# EAGLE design SOIC20-TSSOP20 v1.0 (EAGLE 7.2.0)
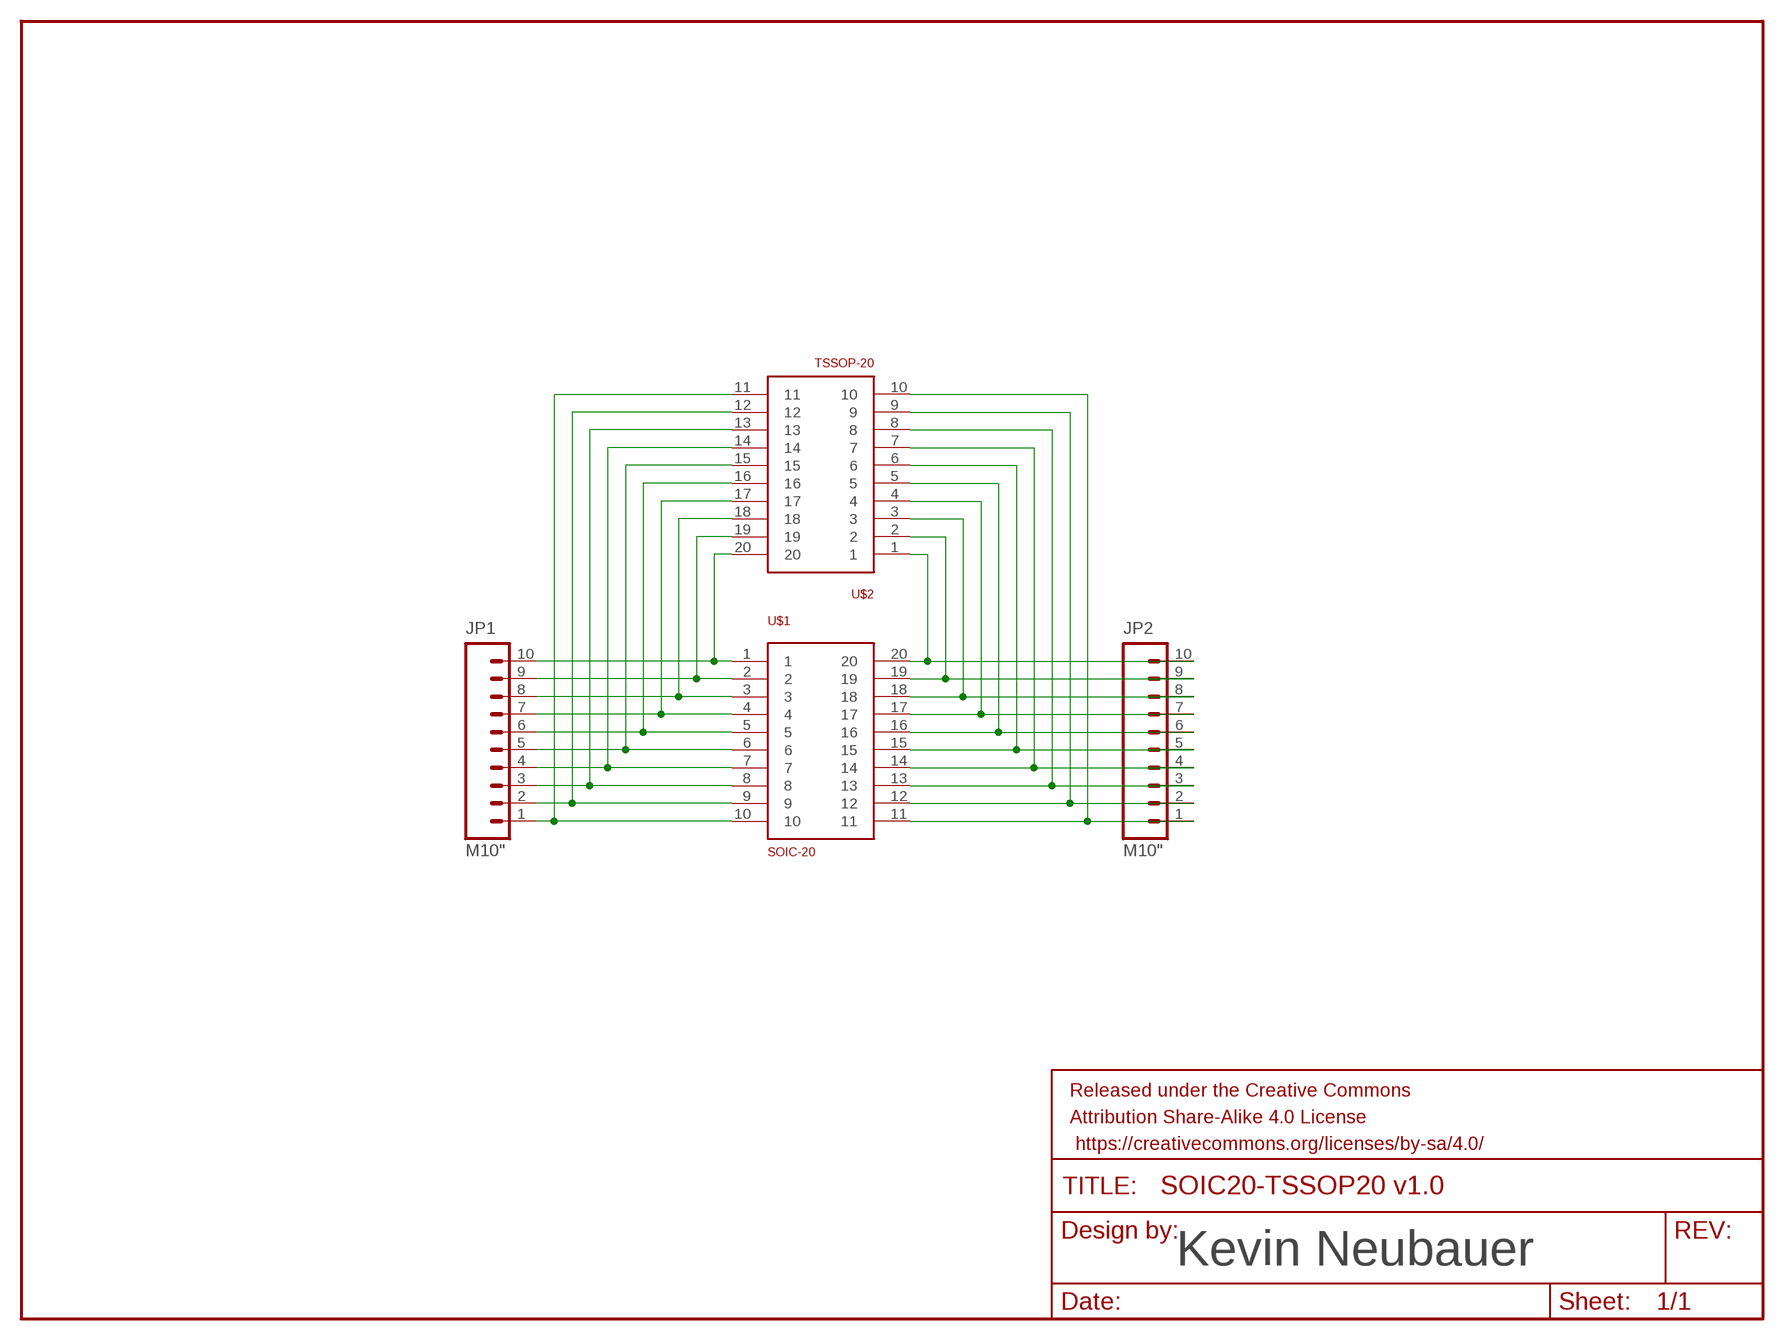
[diagram p0: schematic, sheet 1]

## Parts
FRAME1  FRAME-LETTER  [CREATIVE_COMMONS]
JP1  M10"  [1X10]
JP2  M10"  [1X10]
U$1  SOIC-20  [SOIC-20]
U$2  TSSOP-20  [TSSOP20]

## Nets
N$1: JP1.10 U$1.1 U$2.20
N$2: JP1.9 U$1.2 U$2.19
N$3: JP1.8 U$1.3 U$2.18
N$4: JP1.7 U$1.4 U$2.17
N$5: JP1.6 U$1.5 U$2.16
N$6: JP1.5 U$1.6 U$2.15
N$7: JP1.4 U$1.7 U$2.14
N$8: JP1.3 U$1.8 U$2.13
N$9: JP1.2 U$1.9 U$2.12
N$10: JP1.1 U$1.10 U$2.11
N$11: JP2.10 U$1.20 U$2.1
N$12: JP2.9 U$1.19 U$2.2
N$13: JP2.8 U$1.18 U$2.3
N$14: JP2.7 U$1.17 U$2.4
N$15: JP2.6 U$1.16 U$2.5
N$16: JP2.5 U$1.15 U$2.6
N$17: JP2.4 U$1.14 U$2.7
N$18: JP2.3 U$1.13 U$2.8
N$19: JP2.2 U$1.12 U$2.9
N$20: JP2.1 U$1.11 U$2.10

## Notes on the sheet
- Kevin Neubauer

## Library data of the parts
FRAME1 = SparkFun-Aesthetics:FRAME-LETTER: Schematic Frame Standard 8.5x11 US Letter frame
JP1 JP2 = SparkFun-Connectors:M10: Header 10 Standard 10-pin 0.1" header. Use with straight break away headers (SKU : PRT-00116), right angle break away headers (PRT-00553), swiss pins (PRT-00743), machine pins (PRT-00117), and female headers (PRT-00115).
U$1 = Kevin-GenericICFootprints:SOIC-20
U$2 = Kevin-GenericICFootprints:TSSOP-20

## Board
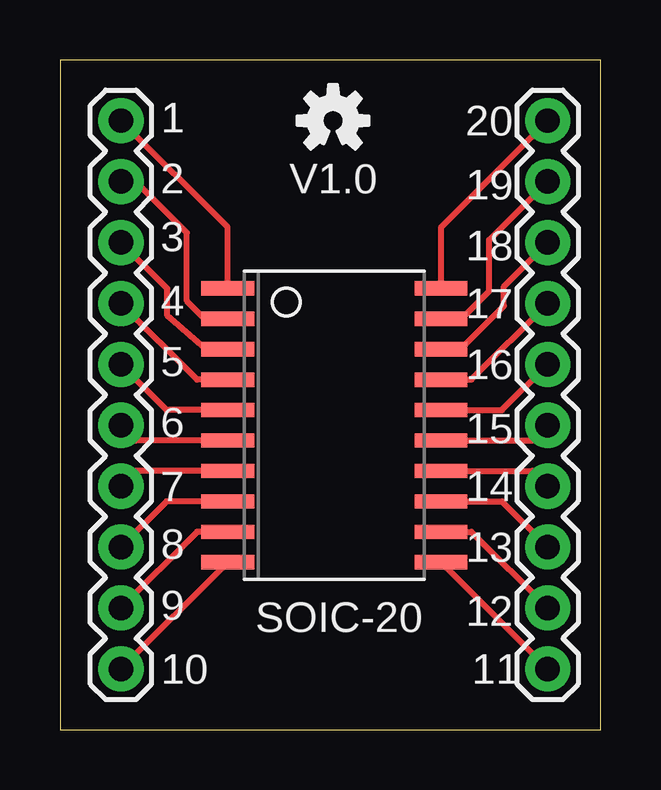
[diagram p1: board, top side]
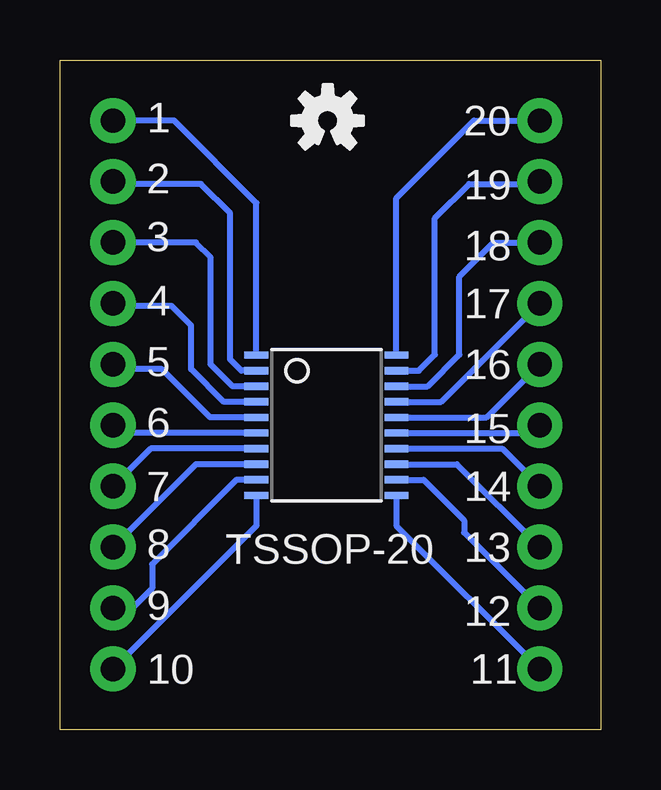
[diagram p2: board, bottom side, seen from below]

Size 22.53 x 27.93 mm. Coordinates in mm from the lower left corner, seen from the top.
Outline: 0,0 22.53,0 22.53,27.93 0,27.93 0,0
Copper layers (1*16): Top 0.035mm / dielectric 1.5mm / Bottom 0.035mm
Design rules "dirt_cheap_dirty_boards.v1": minimum track width 5mil, minimum drill 12mil, track to track 5mil, track to pad 5mil, pad to pad 5mil, via to via 5mil, smd to smd 0mil, copper to edge 10mil, drill to drill 10mil, minimum pad ring 10mil, minimum via ring 6mil, stop-mask expansion 2mil, vias tented up to drill 25mil, thermal gap 10mil

### Footprints (pad centres in the part's own frame; a part is rotated, then mirrored left to right if it is on the bottom)
1X10 = drill 1.016 pad 1.88: 1 0,0; 2 2.54,0; 3 5.08,0; 4 7.62,0; 5 10.16,0; 6 12.7,0; 7 15.24,0; 8 17.78,0; 9 20.32,0; 10 22.86,0
SOIC-20 = smd 0.6 x 2.2: 1 -5.715,-4.445; 2 -4.445,-4.445; 3 -3.175,-4.445; 4 -1.905,-4.445; 5 -0.635,-4.445; 6 0.635,-4.445; 7 1.905,-4.445; 8 3.175,-4.445; 9 4.445,-4.445; 10 5.715,-4.445; 11 5.715,4.445; 12 4.445,4.445; 13 3.175,4.445; 14 1.905,4.445; 15 0.635,4.445; 16 -0.635,4.445; 17 -1.905,4.445; 18 -3.175,4.445; 19 -4.445,4.445; 20 -5.715,4.445
TSSOP20 = smd 0.305 x 0.991: 1 -2.925,-2.918; 2 -2.275,-2.918; 3 -1.625,-2.918; 4 -0.975,-2.918; 5 -0.325,-2.918; 6 0.325,-2.918; 7 0.975,-2.918; 8 1.625,-2.918; 9 2.275,-2.918; 10 2.925,-2.918; 11 2.925,2.918; 12 2.275,2.918; 13 1.625,2.918; 14 0.975,2.918; 15 0.325,2.918; 16 -0.325,2.918; 17 -0.975,2.918; 18 -1.625,2.918; 19 -2.275,2.918; 20 -2.925,2.918

### Placement (x,y rotation side)
FRAME1  -9.65,-9.09 0 top  (outside the outline)
JP1  2.54,2.54 90 top
JP2  20.32,2.54 90 top
U$1  11.43,12.7 270 top
U$2  11.43,12.7 270 bottom
U$3  [OSHW-LOGO-S]  11.38,25.4 0 top
U$4  [OSHW-LOGO-S]  11.38,25.4 0 bottom

### Tracks (layer width: path | path; a pad name or v marks a point on that pad's centre or on a via)
N$1
  Top 0.254: U$1.1 6.99,20.95 JP1.10
  Bottom 0.254: U$2.20 8.51,22.17 5.28,25.4 JP1.10
N$2
  Top 0.254: U$1.2 6.02,17.14 5.28,17.88 5.28,20.73 3.05,22.96 2.64,22.96 JP1.9
  Bottom 0.254: U$2.19 7.58,14.97 6.91,15.65 6.91,21.34 5.49,22.76 2.64,22.76 JP1.9
N$3
  Top 0.254: U$1.3 6.07,15.88 4.47,17.27 4.47,18.39 JP1.8
  Bottom 0.254: U$2.18 7.21,14.32 5.89,15.65 5.89,18.9 4.47,20.32 JP1.8
N$4
  Top 0.254: U$1.4 5.71,14.61 JP1.7
  Bottom 0.254: U$2.17 6.64,13.68 JP1.7
N$5
  Top 0.254: U$1.5 4.45,13.34 JP1.6
  Bottom 0.254: U$2.16 4.75,13.03 JP1.6
N$6
  Top 0.254: U$1.6 3.17,12.06 JP1.5
  Bottom 0.254: U$2.15 2.87,12.38 JP1.5
N$7
  Top 0.254: U$1.7 3.17,10.79 JP1.4
  Bottom 0.254: U$2.14 4.11,11.72 JP1.4
N$8
  Top 0.254: U$1.8 4.45,9.53 JP1.3
  Bottom 0.254: U$2.13 6,11.07 JP1.3
N$9
  Top 0.254: U$1.9 5.71,8.26 JP1.2
  Bottom 0.254: U$2.12 7.38,10.43 5.69,8.74 5.69,8.23 JP1.2
N$10
  Top 0.254: U$1.10 JP1.1
  Bottom 0.254: U$2.11 8.51,8.51 JP1.1
N$11
  Top 0.254: U$1.20 15.88,20.95 JP2.10
  Bottom 0.254: U$2.1 14.35,21.97 17.78,25.4 JP2.10
N$12
  Top 0.254: U$1.19 16.74,17.14 17.88,18.29 17.88,20.42 JP2.9
  Bottom 0.254: U$2.2 14.97,14.97 15.44,15.44 15.44,21.54 16.66,22.76 20.22,22.76 JP2.9
N$13
  Top 0.254: U$1.18 16.69,15.88 18.49,17.68 18.49,18.49 JP2.8
  Bottom 0.254: U$2.3 15.34,14.32 16.26,15.24 16.26,19.71 16.87,20.32 JP2.8
N$14
  Top 0.254: U$1.17 17.14,14.61 JP2.7
  Bottom 0.254: U$2.4 15.71,13.68 17.07,15.04 17.07,16.87 17.88,17.68 20.22,17.68 JP2.7
N$15
  Top 0.254: U$1.16 18.41,13.34 JP2.6
  Bottom 0.254: U$2.5 16.28,13.03 18.29,15.04 20.12,15.04 JP2.6
N$16
  Top 0.254: U$1.15 19.68,12.06 JP2.5
  Bottom 0.254: U$2.6 20,12.38 JP2.5
N$17
  Top 0.254: U$1.14 19.68,10.79 JP2.4
  Bottom 0.254: U$2.7 18.75,11.72 JP2.4
N$18
  Top 0.254: U$1.13 18.41,9.53 JP2.3
  Bottom 0.254: U$2.8 16.86,11.07 JP2.3
N$19
  Top 0.254: U$1.12 17.14,8.26 JP2.2
  Bottom 0.254: U$2.9 15.18,10.43 18.69,6.91 18.69,5.89 19.51,5.08 JP2.2
N$20
  Top 0.254: U$1.11 JP2.1
  Bottom 0.254: U$2.10 14.35,8.51 JP2.1

### Text on the board
tPlace: 1 | 20 | 2 | V1.0 | 19 | 3 | 18 | 4 | 17 | 5 | 16 | 6 | 15 | 7 | 14 | 8 | 13 | 9 | SOIC-20 | 12 | 10 | 11
bPlace: 20 | 1 | 19 | 2 | 18 | 3 | 17 | 4 | 16 | 5 | 15 | 6 | 14 | 7 | 13 | TSSOP-20 | 8 | 9 | 12 | 11 | 10
tDocu: Kevin Neubauer